# Altium schematic sheet Current_sense.SchDoc
size A4
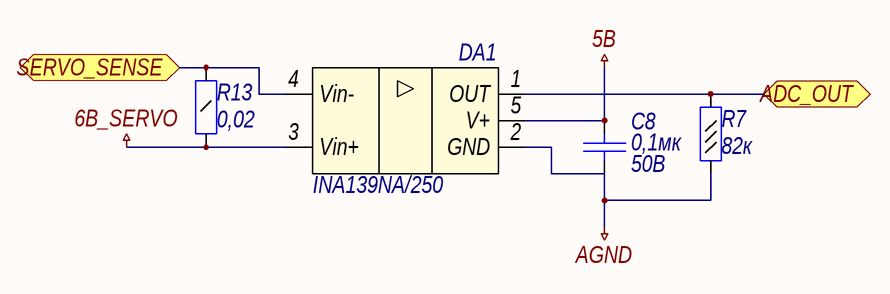
[diagram p0: Current_sense.SchDoc]

## Parts
C8  Voltage: 50B  [C0603]  (hidden comment: 0,1мк)
DA1  INA139NA/250  [SOT23-5]
R7  value 82к  [R0603]  (hidden comment: Resistor_0,062Вт)
R13  value 0,02  [R1206]  (hidden comment: Resistor_0,25Вт)

## Ports
ADC_OUT, SERVO_SENSE

## Nets
5В: C8.2 DA1.5(V+)
6В_SERVO: DA1.3(Vin+) R13.1
AGND: C8.1 DA1.2(GND) R7.1
ADC_OUT: DA1.1(OUT) R7.2 ; port ADC_OUT
SERVO_SENSE: DA1.4(Vin-) R13.2 ; port SERVO_SENSE

## Library data of the parts
C8 = cap131: Конденсатор; Part Name: Ceramic; Manufacture: Murata; Part Number: GRM188R71H104KA93D; id: cap131; TKE: X7R; Value: 0,1мк
DA1 = amp3: Измерительный датчик тока; Part Name: Measurement Current Shunt Monitor; Manufacture: Texas Instruments; id: amp3; Rail-to-rail: independent; Supply Voltage: 2,7-5-40B; Supply Current max: 60uA; Bandwidth: rout=20  220kHz; Input Bias Current: 10uA; CMRR: 115dB; Offset voltage: 0,2mB; Channels: 1; Part Number: INA139NA/250
R7 = res509: Резистор; Manufacture: Yageo; Part Number: RC0603FR-0782KL; id: res509; Accuracy: 0,01; Part Name: Resistor; Power: 0,062Вт
R13 = res1246: Резистор; Part Name: Shunt; Manufacture: Yageo; Part Number: RL1206FR-070R02L; Accuracy: 0,01; Power: 0,25Вт; id: res1246